# EAGLE design Zio Qwiic Current Sensor INA219 (EAGLE 9.1.1)
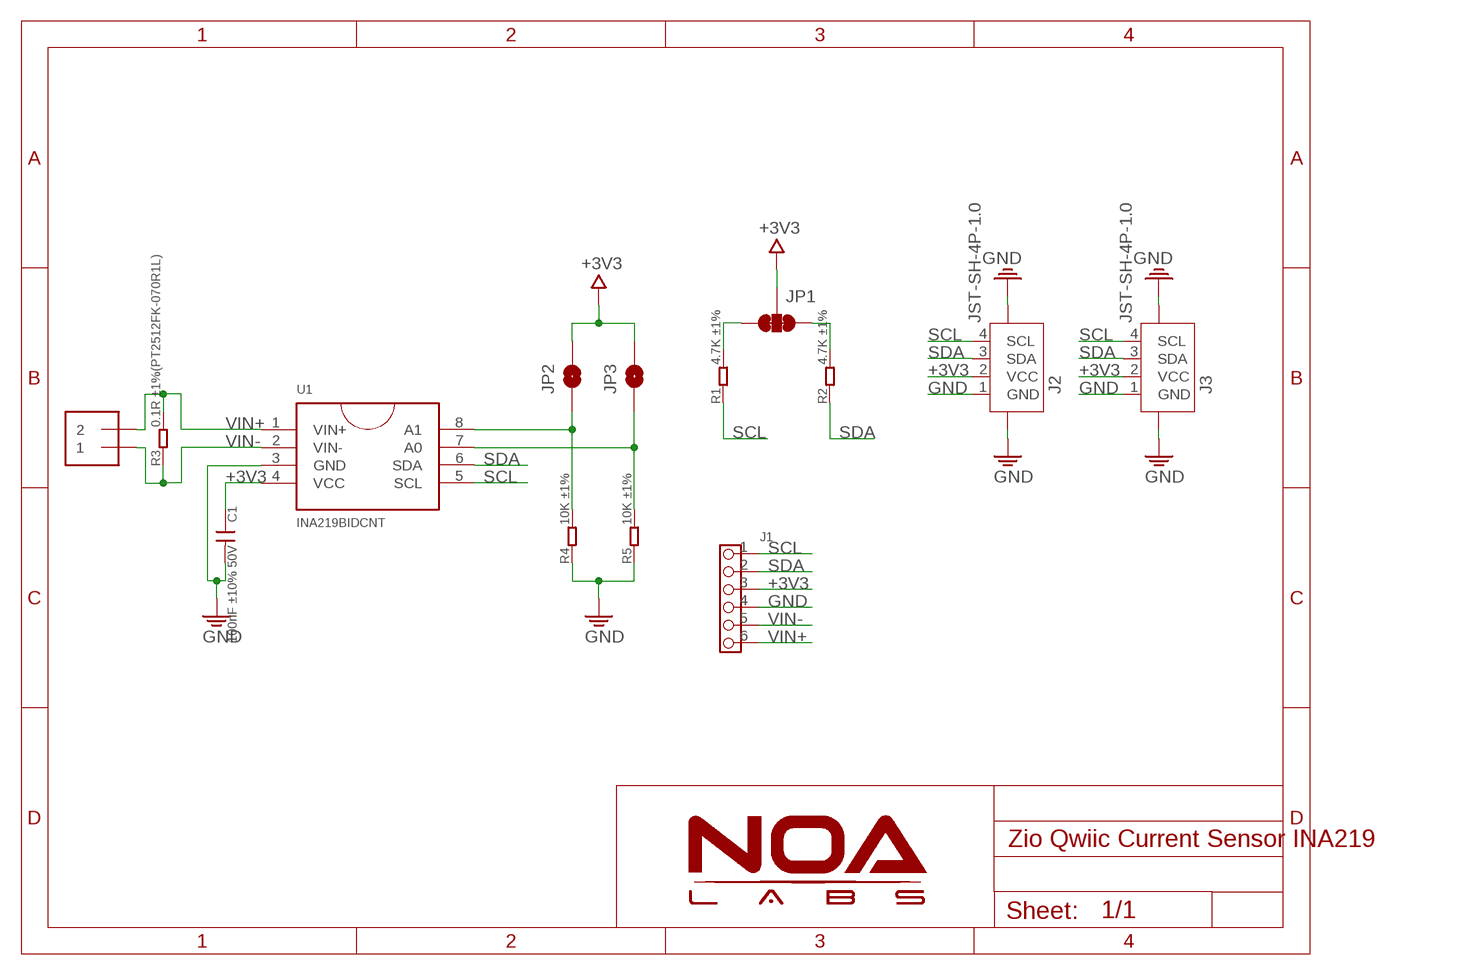
[diagram p0: schematic, sheet 1]

## Parts
C1  100nF ±10% 50V  C-0603  [C0603]
J1  HEADER-6P-60/35MIL  [6P-2.54-60/35MIL]
J2  JST-SH-4P-1.0  [JST-SH-4P]
J3  JST-SH-4P-1.0  [JST-SH-4P]
J6  TERMBLOCK_1X2-3.5MM  [1X2-3.5MM]
JP1  SMT-JUMPER_3_2-NC_TRACE  [SMT-JUMPER_3_2-NC_TRACE]
JP2  JUMPER-SMT_2_NC_PASTE_NOCREM  [SMT-JUMPER_2_NC_PASTE_SILK_NOCREM]
JP3  JUMPER-SMT_2_NC_PASTE_NOCREM  [SMT-JUMPER_2_NC_PASTE_SILK_NOCREM]
R1  4.7K ±1%  R-0603  [R0603]
R2  4.7K ±1%  R-0603  [R0603]
R3  0.1R ±1%(PT2512FK-070R1L)  R-2512  [R2512]
R4  10K ±1%  R-0603  [R0603]
R5  10K ±1%  R-0603  [R0603]
U1  INA219BIDCNT  INA219  [SOT23-8]

## Nets
+3V3: C1.1 J1.3 J2.2(VCC) J3.2(VCC) JP1.2 JP2.2 JP3.2 U1.4(VCC)
GND: C1.2 J1.4 J2.1(GND) J2.NC1 J2.NC2 J3.1(GND) J3.NC1 J3.NC2 R4.1 R5.1 U1.3(GND)
N$1: JP2.1 R4.2 U1.8(A1)
N$2: JP3.1 R5.2 U1.7(A0)
N$6: JP1.3 R1.2
N$8: JP1.1 R2.2
SCL: J1.1 J2.4(SCL) J3.4(SCL) R1.1 U1.5(SCL)
SDA: J1.2 J2.3(SDA) J3.3(SDA) R2.1 U1.6(SDA)
VIN+: J1.6 J6.2 R3.2 U1.1(VIN+)
VIN-: J1.5 J6.1 R3.1 U1.2(VIN-)

## Library data of the parts
C1 = RCL:C
J1 = Connector_NOA:HEADER-6P
J2 J3 = Connector:JST-SH-4P
J6 = microbuilder:TERMBLOCK_1X2: 3.5mm Terminal block http://www.ladyada.net/library/pcb/eaglelibrary.html
JP1 = NOA-Jumpers:SMT-JUMPER_3_2-NC_TRACE
JP2 JP3 = NOA-Jumpers:JUMPER-SMT_2_NC_PASTE_NOCREM
R1-R5 = RCL:R
U1 = IC:INA219: INA219 - I2C Current/Power Monitor Voltage Range: 0-26V Accuracy: 0.5% Temperature: -40°C - 125°C

## Board
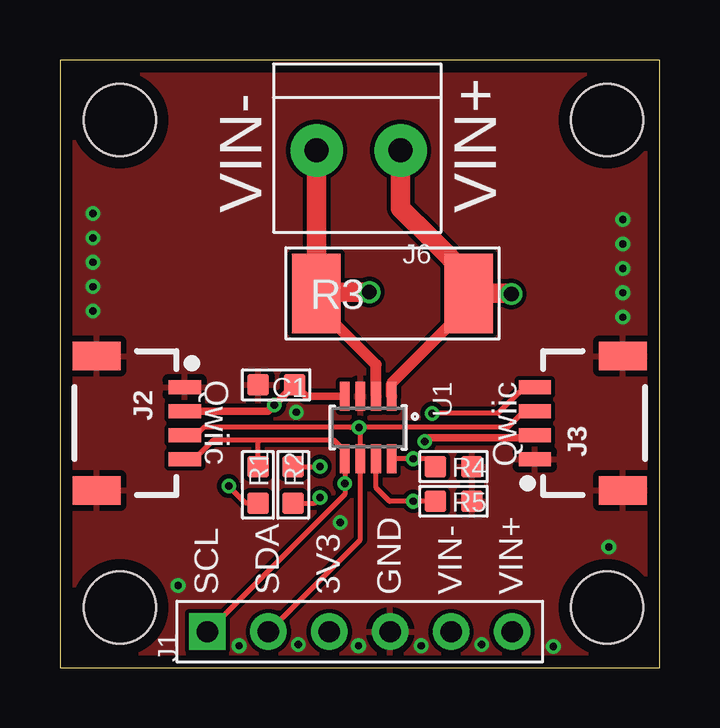
[diagram p1: board, top side]
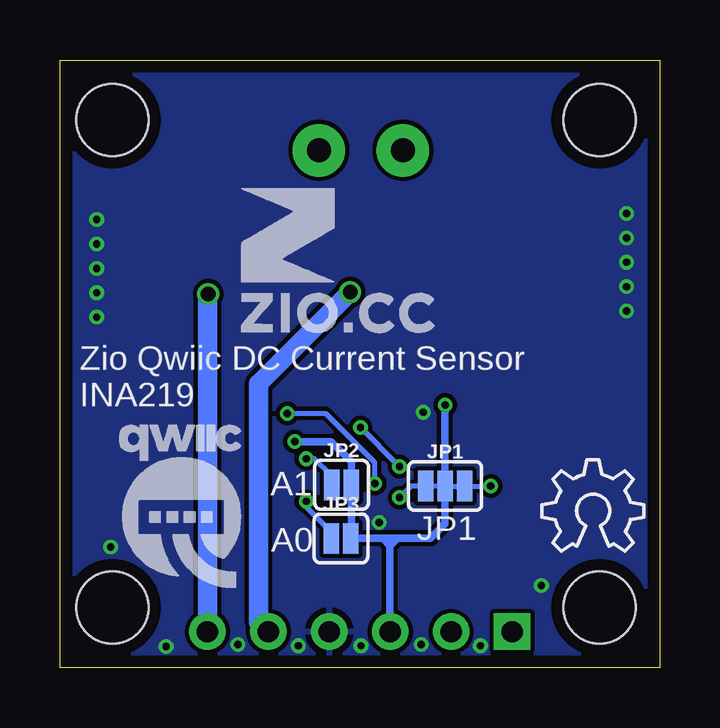
[diagram p2: board, bottom side, seen from below]

Size 25 x 25.32 mm. Coordinates in mm from the lower left corner, seen from the top.
Outline: 0,0 25,0 25,25.32 0,25.32 0,0
Copper layers (1*16): Top 0.035mm / dielectric 1.5mm / Bottom 0.035mm
Design rules "NOA Eagle Rule": minimum track width 7mil, minimum drill 12mil, track to track 7mil, track to pad 7mil, pad to pad 7mil, via to via 7mil, smd to smd 0mil, copper to edge 20mil, drill to drill 10mil, minimum pad ring 10mil, minimum via ring 6mil, stop-mask expansion 2mil, vias tented up to drill 25mil, thermal gap 10mil
Holes 3 mm at 2.5,2.5 22.82,2.5 2.5,22.82 22.82,22.82

### Footprints (pad centres in the part's own frame; a part is rotated, then mirrored left to right if it is on the bottom)
C0603 = smd 0.889 x 0.889: 1 -0.762,0; 2 0.762,0
6P-2.54-60/35MIL = drill 0.889 pad 1.524 square: 1 0,6.35 | drill 0.889 pad 1.524: 2 0,3.81; 3 0,1.27; 4 0,-1.27; 5 0,-3.81; 6 0,-6.35
JST-SH-4P = smd 0.6 x 1.35: 1 1.5,0; 2 0.5,0; 3 -0.5,0; 4 -1.5,0 | smd 1.2 x 2: NC1 -2.8,3.675; NC2 2.8,3.675
1X2-3.5MM = drill 1 pad 2.184: 1 1.8,0; 2 -1.7,0
SMT-JUMPER_3_2-NC_TRACE = smd 0.635 x 1.27: 1 -0.813,0; 2 0,0; 3 0.813,0
SMT-JUMPER_2_NC_PASTE_SILK_NOCREM = smd 0.635 x 1.27: 1 -0.406,0; 2 0.406,0
R0603 = smd 0.889 x 0.889: 1 -0.762,0; 2 0.762,0
R2512 = smd 2.032 x 3.302: 1 -3.175,0; 2 3.175,0
SOT23-8 = smd 1.2 x 0.4: 1 -1.3,0.975; 2 -1.3,0.325; 3 -1.3,-0.325; 4 -1.3,-0.975; 5 1.3,-0.975; 6 1.3,-0.325; 7 1.3,0.325; 8 1.3,0.975

### Placement (x,y rotation side)
C1  9.02,11.79 180 top
J1  12.5,1.5 90 top
J2  5.2,10.19 90 top
J3  19.8,10.19 270 top
J6  12.5,21.55 180 top
JP1  8.94,7.57 0 bottom
JP2  13.26,7.62 0 bottom
JP3  13.28,5.38 0 bottom
R1  8.26,7.62 270 top
R2  9.73,7.62 270 top
R3  13.87,15.6 0 top
R4  16.41,8.38 180 top
R5  16.41,6.93 180 top
U1  12.85,10.01 270 top
U$3  [6MM]  17.48,13.97 0 bottom
U$4  [QWIIC-LOGO-MEDIUM]  19.99,6.78 0 bottom
U$5  [OSHW_6X150_NOTEXT]  4.9,4.85 0 bottom

### Tracks (layer width: path | path; a pad name or v marks a point on that pad's centre or on a via)
+3V3  (via drill 0.3)
  Top 0.305: J3.2 19.69,9.58 15.37,9.58 v15.21,9.42 | J2.2 8.68,10.69 v8.94,10.95 C1.1 10.26,11.31 U1.4
  Bottom 0.305: v15.21,9.42 13.69,9.42 12.85,8.59 JP2.2 12.85,5.41 JP3.2 11.58,5.38 | v8.94,10.95 JP1.2 8.94,5.99 9.55,5.38 10.92,5.38 | 10.92,5.38 11.58,5.38 | J1.3 11.23,5.08 | 11.23,5.08 10.92,5.38 | 11.23,5.08 11.54,5.38 11.58,5.38
GND  (via drill 0.3)
  other vias: 15.06,0.91 12.45,0.91 9.93,0.97 7.47,0.91 17.58,0.97 20.57,0.89 11.68,6.05 9.86,10.64 22.89,5.03 4.93,3.43 1.37,18.92 1.37,17.91 1.37,16.89 1.37,15.88 1.37,14.86 23.47,14.61 23.47,15.62 23.47,16.64 23.47,17.65 23.47,18.67
  pour Bottom: 0,25.32 24.99,25.32 24.99,0 0,0
  pour Top: 0,25.32 24.99,25.32 24.99,0 0,0
N$1  (via drill 0.3)
  Top 0.203: U1.8 v14.73,8.71 15.32,8.71 R4.2
  Bottom 0.203: JP2.1 13.66,7.98 14.4,8.71 v14.73,8.71
N$2  (via drill 0.3)
  Top 0.203: U1.7 13.18,7.5 13.74,6.93 v14.73,6.93 R5.2
  Bottom 0.203: JP3.1 13.69,5.66 14.73,6.71 v14.73,6.93
N$6  (via drill 0.3)
  Top 0.203: R1.2 7.75,6.86 v7.04,7.57
  Bottom 0.203: JP1.3 v7.04,7.57
N$8  (via drill 0.3)
  Top 0.203: R2.2 10.62,6.86 v10.85,7.09
  Bottom 0.203: JP1.1 10.36,7.57 v10.85,7.09
SCL  (via drill 0.3)
  Top 0.203: 8.33,9.47 11.43,9.47 11.88,9.03 U1.5 v11.88,7.67 11.88,7.23 J1.1 | 8.33,9.47 6.38,9.47 5.59,8.69 J2.4 | R1.1 8.26,9.4 8.33,9.47 | J3.4 19.36,11.69 18.26,10.59 v15.52,10.59
  Bottom 0.203: v15.52,10.59 13.92,10.59 11.88,8.55 v11.88,7.67
SDA  (via drill 0.3)
  Top 0.203: J2.3 5.67,9.69 5.99,10.01 12.1,10.01 v12.47,10.01 12.52,10.01 | J1.2 12.53,5.34 U1.6 12.53,10 12.52,10.01 | R2.1 v10.85,8.38 | J3.3 19.35,10.69 18.67,10.01 12.52,10.01
  Bottom 0.203: v10.85,8.38 v12.47,10.01
VIN+  (via drill 0.61)
  Top 0.457: U1.1 13.83,11.85 17.04,15.06 R3.2 17.04,16.31
  Top 0.813: J6.2 14.2,19.15 15.48,17.87 17.04,16.31 | v18.82,15.57 18.8,15.6 R3.2
  Bottom 0.813: J1.6 18.85,15.54 v18.82,15.57
VIN-  (via drill 0.61)
  Top 0.457: U1.2 13.18,12.63 11.37,14.44 11.37,14.92 R3.1
  Top 0.813: J6.1 10.7,16.97 | 10.7,16.97 R3.1 | v12.9,15.65 10.74,15.65 R3.1 | R3.1 | R3.1 10.7,16.97
  Bottom 0.813: J1.5 16.71,1.9 16.71,11.84 v12.9,15.65

### Text on the board
tPlace: VIN- | VIN+ | Qwiic | Qwiic | SCL | SDA | 3V3 | GND | VIN- | VIN+
bPlace: Zio Qwiic DC Current Sensor / INA219 | A1 | JP1 | A0